# Altium schematic sheet USB.SchDoc
size A
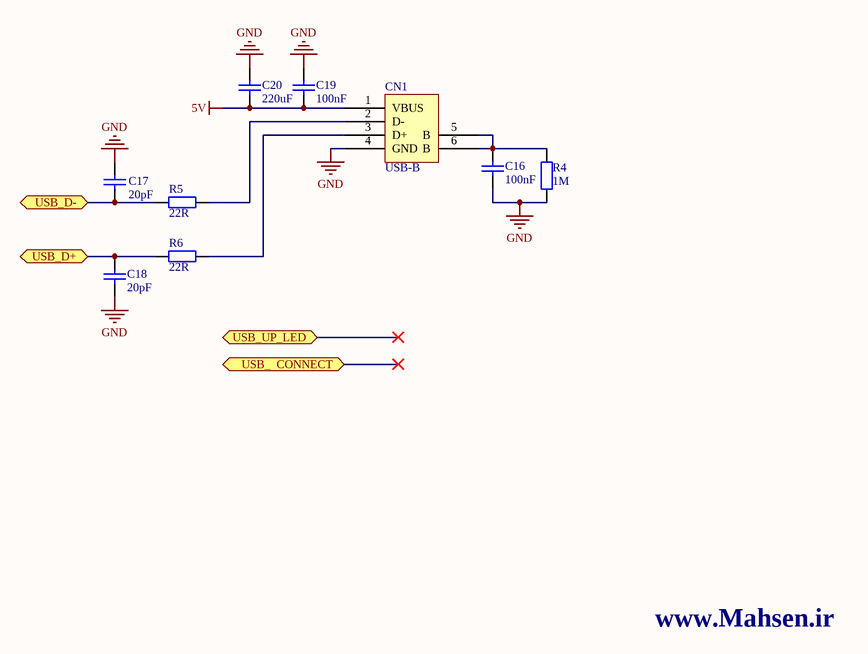
[diagram p0: USB.SchDoc]

## Parts
C16  100nF  [0805]
C17  20pF  [0805]
C18  20pF  [0805]
C19  100nF  [0805]
C20  220uF  [0805]
CN1  USB-B  [CONN_USB]
R4  1M  [0805]
R5  22R  [0805]
R6  22R  [0805]

## Ports
USB_  CONNECT (bidir), USB_D+ (bidir), USB_D- (bidir), USB_UP_LED (bidir)

## Nets
5V: C19.2 C20.2 CN1.1(VBUS)
GND: C16.2 C17.1 C18.2 C19.1 C20.1 CN1.4(GND) R4.1
USB_D+: C18.1 R6.2 ; port USB_D+
USB_D-: C17.2 R5.2 ; port USB_D-
NetC16_1: C16.1 CN1.5(B) CN1.6(B) R4.2
NetCN1_2: CN1.2(D-) R5.1
NetCN1_3: CN1.3(D+) R6.1

## Notes on the sheet
- www.Mahsen.ir

## Library data of the parts
C16-C20 = Cap: Capacitor; Published: 8-Jun-2000; LatestRevisionDate: 17-Jul-2002; LatestRevisionNote: Re-released for DXP Platform.; PackageReference: RAD-0.3; Publisher: Altium Limited; PackageDescription: Radial Cap, Thru-Hole; 2 Leads; 0.3 in Pin Spacing
  C16 C19: Value: 100nF
  C17 C18: Value: 20pF
  C20: Value: 220uF
R4-R6 = Res2: Resistor; Published: 8-Jun-2000; LatestRevisionDate: 17-Jul-2002; LatestRevisionNote: Re-released for DXP Platform.; PackageReference: AXIAL-0.4; Publisher: Altium Limited; PackageDescription: Axial Device, Thru-Hole; 2 Leads; 0.4 in Pin Spacing
  R4: Value: 1M
  R5 R6: Value: 22R